# Altium project H-Bridge_Nucleo_Breakout_25.PrjPcb
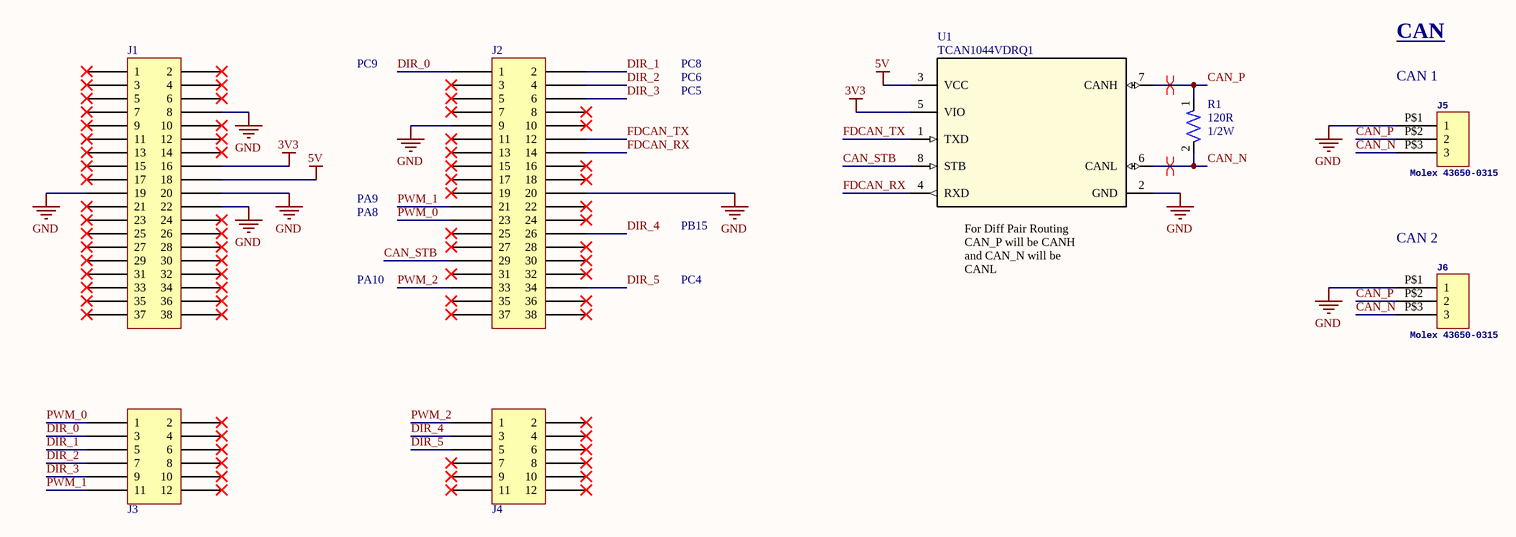
[diagram p0: nucleo_breakout.SchDoc]
1 sheet, 8 parts. Net scope: global (net labels, ports and power ports of the same name join across sheets).
Board file: nucleo_breakout.PcbDoc

## Sheet nucleo_breakout.SchDoc
size Legal; SheetNumber: 1; SheetTotal: 1

### Parts
J1  PPPC192LFBN-RC  [CONN-38POS_01]  (value not drawn)
J2  PPPC192LFBN-RC  [CONN-38POS_01]  (value not drawn)
J3  PPTC062LFBN-RC  [CONN-6POS_01]  (value not drawn)
J4  PPTC062LFBN-RC  [CONN-6POS_01]  (value not drawn)
J5  Molex 43650-0315  [43650-0315]
J6  Molex 43650-0315  [43650-0315]
R1  Power: 1/2W  Resistance: 120R  [RES-1210]  (hidden comment: RC1210FR-07120RL)
U1  TCAN1044VDRQ1  [IC-8SOIC]

### Nets
3V3: J1.16 U1.5(VIO)
5V: J1.18 U1.3(VCC)
GND: J1.8 J1.19 J1.20 J1.22 J2.9 J2.20 J5.P$1(1) J6.P$1(1) U1.2(GND)
CAN_N: J5.P$3(3) J6.P$3(3) R1.2 U1.6(CANL)
CAN_P: J5.P$2(2) J6.P$2(2) R1.1 U1.7(CANH)
CAN_STB: J2.29 U1.8(STB)
DIR_0: J2.1 J3.3
DIR_1: J2.2 J3.5
DIR_2: J2.4 J3.7
DIR_3: J2.6 J3.9
DIR_4: J2.26 J4.3
DIR_5: J2.34 J4.5
FDCAN_RX: J2.14 U1.4(RXD)
FDCAN_TX: J2.12 U1.1(TXD)
PWM_0: J2.23 J3.1
PWM_1: J2.21 J3.11
PWM_2: J2.33 J4.1

Not connected (* = marked no-connect by the designer): J1 1* 2* 3* 4* 5* 6* 7* 9* 10* 11* 12* 13* 14* 15* 17* 21* 23* 24* 25* 26* 27* 28* 29* 30* 31* 32* 33* 34* 35* 36* 37* 38*; J2 3* 5* 7* 8* 10* 11* 13* 15* 16* 17* 18* 19* 22* 24* 25* 27* 28* 30* 31* 32* 35* 36* 37* 38*; J3 2* 4* 6* 8* 10* 12*; J4 2* 4* 6* 7* 8* 9* 10* 11* 12*

### Layout directives
differential pair: CAN_N, CAN_P

### Notes on the sheet
- CAN
- PC9
- PC8
- PC6
- PC5
- (near J5) CAN 1
- PA8
- PA9
- PB15
- (near J6) CAN 2
- PA10
- PC4
- (near U1) For Diff Pair Routing CAN_P will be CANH and CAN_N will be CANL

### Library data of the parts
J1 J2 = CONN-38POS-01
J3 J4 = CONN-12POS-01: 12 Position Header Connector 0.100" (2.54mm) Through Hole Tin
J5 J6 = Micro-Fit Molex 3 Pin Vertical: GateName_1: G$1; SymbolName_1: HEADER_POS3; DeviceSetName: HEADER_POS3_?; DeviceName: 43650-0315; LibraryName: con-molex-micro-fit-3_0_2; Package: 43650-0315
R1 = RES-120-0001: RES 120 OHM 1% 1/2W 1210; Tolerance: 1%; Size: 1210; ComponentLink1Description: Datasheet; ComponentLink1URL: https://www.yageo.com/upload/media/product/products/datasheet/rchip/PYu-RC_Group_51_RoHS_L_12.pdf
U1 = IC-CAN-0001: IC TRANSCEIVER 1/1 8SOIC; ComponentLink1Description: Datasheet; ComponentLink1URL: https://www.ti.com/lit/ds/symlink/tcan1044-q1.pdf?HQS=dis-dk-null-digikeymode-dsf-pf-null-wwe&ts=1728758303289&ref_url=https%253A%252F%252Fwww.ti.com%252Fgeneral%252Fdocs%252Fsuppproductinfo.tsp%253FdistId%253D10%2526gotoUrl%253Dhttps%253A%252F%252Fwww.ti.com%252Flit%252Fgpn%252Ftcan1044-q1